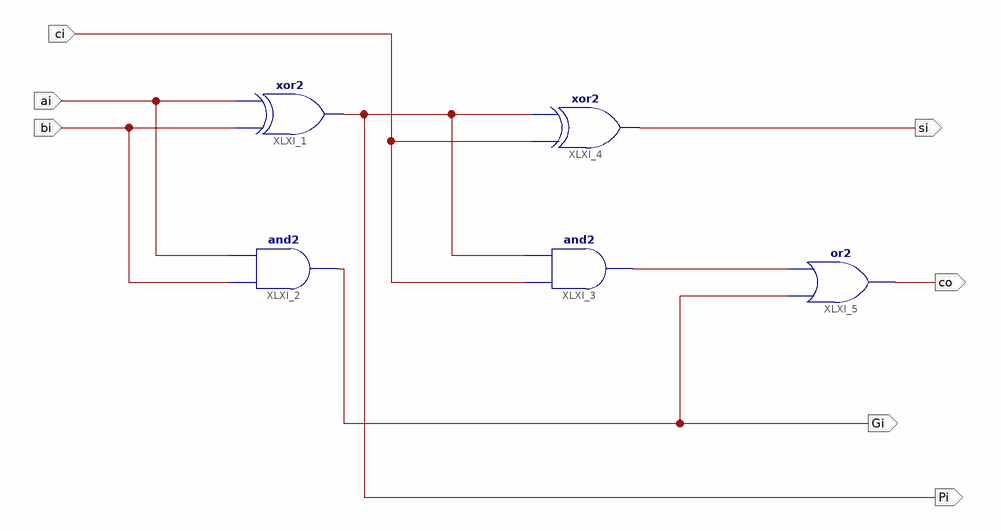
[diagram p0: schematic sheet 1]
// Xilinx ISE schematic add.sch (kintex7) as structural Verilog: 5 symbols, 7 ports
module add (
  input  ai,
  input  bi,
  input  ci,
  output Pi,
  output Gi,
  output si,
  output co
);

  wire XLXN_11;

  xor XLXI_1 (Pi, bi, ai);
  and XLXI_2 (Gi, bi, ai);
  and XLXI_3 (XLXN_11, ci, Pi);
  xor XLXI_4 (si, ci, Pi);
  or XLXI_5 (co, Gi, XLXN_11);
endmodule
